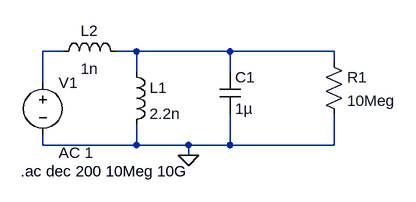
[diagram p0: schematic Draft4.asc]
Draft4.asc, the LTspice schematic file:
Version 4
SHEET 1 880 680
WIRE 16 176 -16 176
WIRE 128 176 96 176
WIRE 272 176 128 176
WIRE 432 176 272 176
WIRE 432 192 432 176
WIRE 128 208 128 176
WIRE 272 208 272 176
WIRE -16 224 -16 176
WIRE -16 320 -16 304
WIRE 128 320 128 288
WIRE 128 320 -16 320
WIRE 208 320 128 320
WIRE 272 320 272 272
WIRE 272 320 208 320
WIRE 432 320 432 272
WIRE 432 320 272 320
WIRE 208 336 208 320
FLAG 208 336 0
SYMBOL cap 256 208 R0
SYMATTR InstName C1
SYMATTR Value 1µ
SYMBOL res 416 176 R0
SYMATTR InstName R1
SYMATTR Value 10Meg
SYMBOL voltage -16 208 R0
WINDOW 123 24 124 Left 2
WINDOW 39 0 0 Left 0
SYMATTR InstName V1
SYMATTR Value ""
SYMATTR Value2 AC 1
SYMBOL ind 112 192 R0
SYMATTR InstName L1
SYMATTR Value 2.2n
SYMBOL ind 0 192 R270
WINDOW 0 32 56 VTop 2
WINDOW 3 5 56 VBottom 2
SYMATTR InstName L2
SYMATTR Value 1n
TEXT -50 360 Left 2 !.ac dec 200 10Meg 10G

The netlist it stands for:
* Draft4.asc
C1 N002 0 1µ
R1 N002 0 10Meg
V1 N001 0 AC 1
L1 N002 0 2.2n
L2 N001 N002 1n
.ac dec 200 10Meg 10G
.backanno
.end